# EAGLE design HBSTICK (EAGLE 9.6.2)
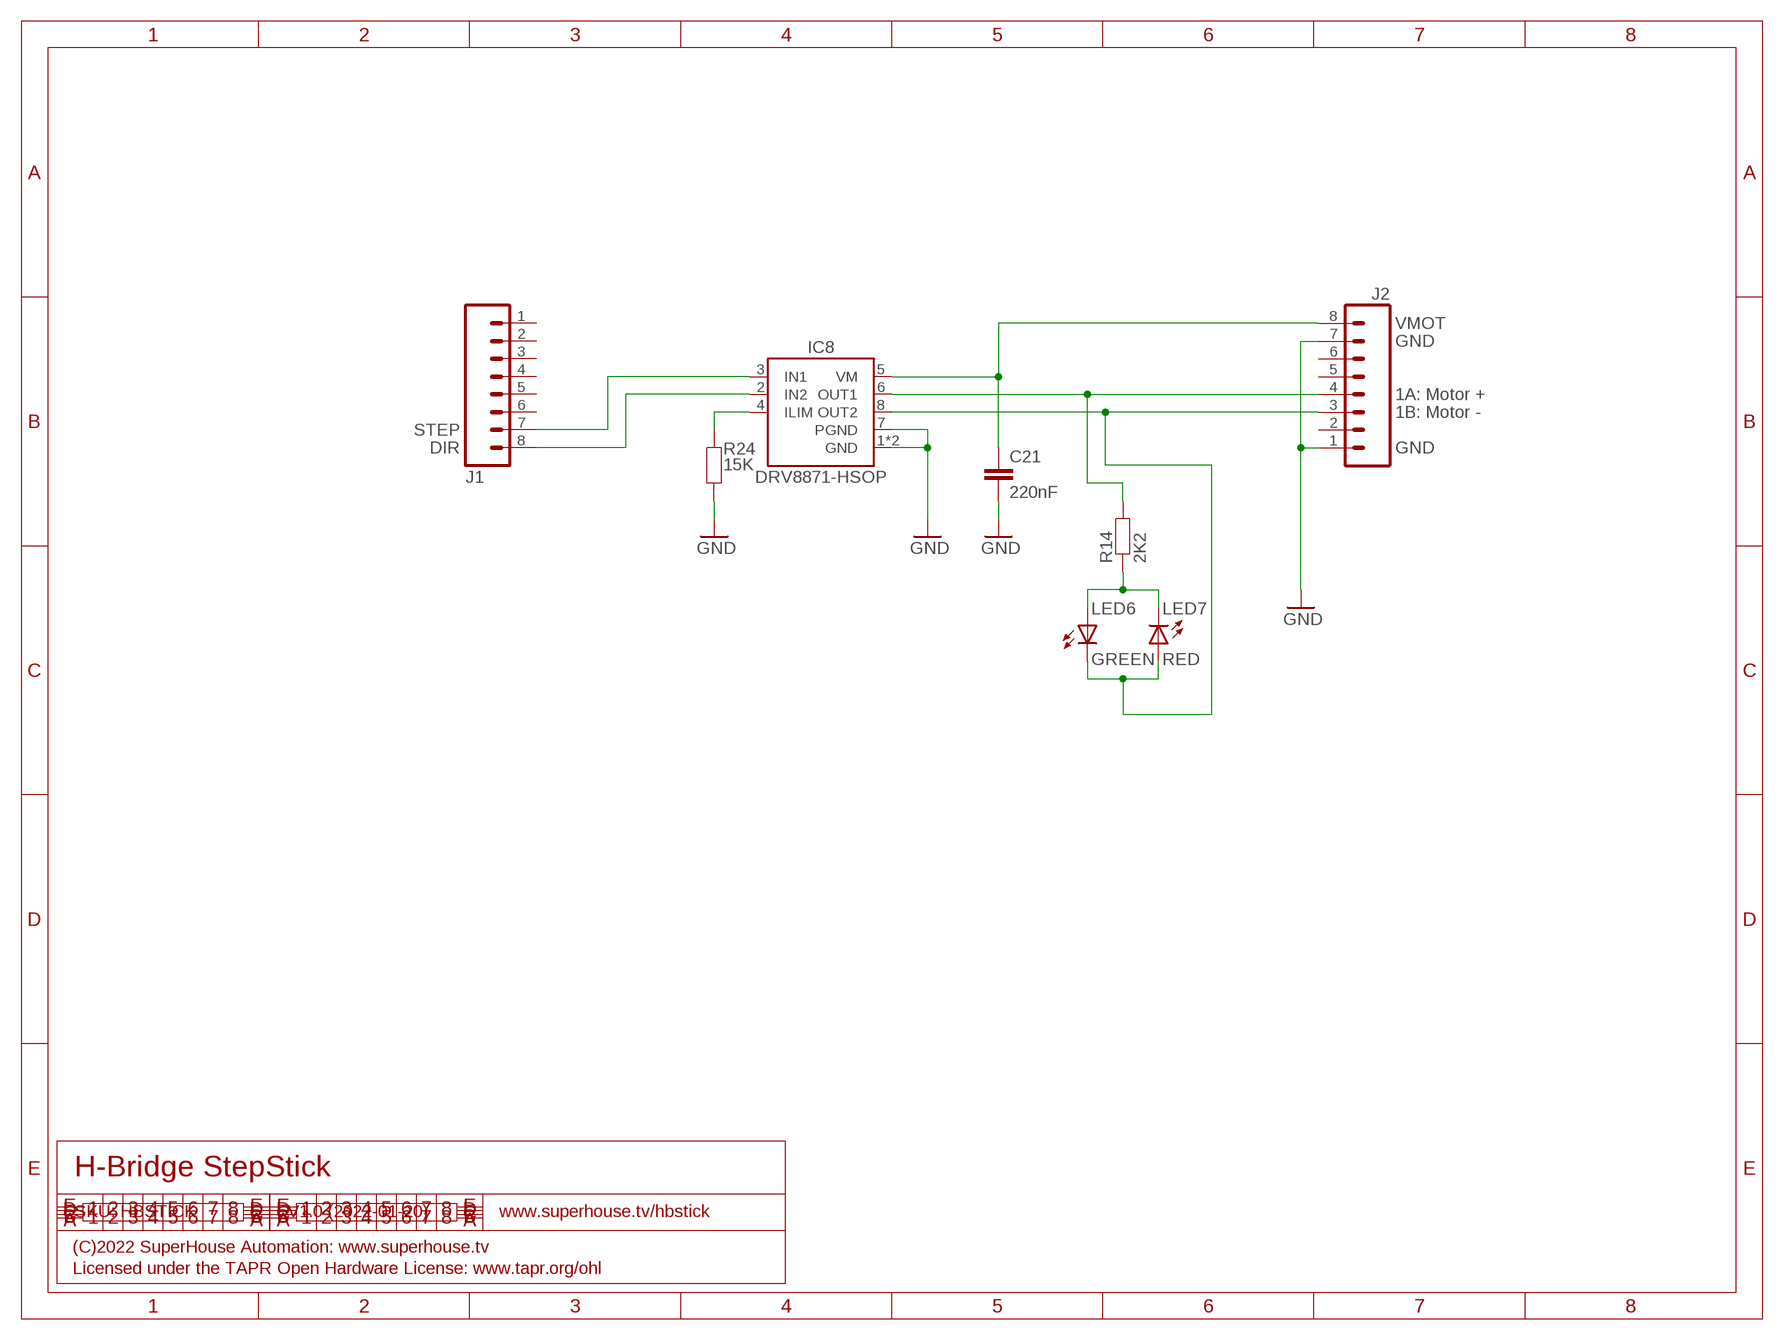
[diagram p0: schematic, sheet 1]

## Parts
C21  220nF  CAP0603  [C0603]
IC8  DRV8871-HSOP  [SOIC8T]
J1  M08-PIN-BELOW  [1X08-P-BELOW]
J2  M08-PIN-BELOW  [1X08-P-BELOW]
LED6  GREEN  LED0603  [LED-0603]
LED7  RED  LED0603  [LED-0603]
R14  2K2  RESISTOR0603  [R0603]
R24  15K  RESISTOR0603  [R0603]

## Nets
GND: C21.2 IC8.1(GND) IC8.7(PGND) IC8.TGND(GND) J2.1 J2.7 R24.1
MOTOR+: IC8.6(OUT1) J2.4 R14.2
MOTOR-: IC8.8(OUT2) J2.3 LED6.C LED7.A
N$1: IC8.2(IN2) J1.8
N$2: IC8.3(IN1) J1.7
N$8: LED6.A LED7.C R14.1
N$12: IC8.4(ILIM) R24.2
VIN+: C21.1 IC8.5(VM) J2.8
Unconnected: J1.1 J1.2 J1.3 J1.4 J1.5 J1.6 J2.2 J2.5 J2.6

## Notes on the sheet
- VMOT
- GND
- 1A: Motor +
- 1B: Motor -
- STEP
- DIR | GND
- H-Bridge StepStick
- SKU: HBSTICK | V1.0 (2022-01-20) | www.superhouse.tv/hbstick
- (C)2022 SuperHouse Automation: www.superhouse.tv
- Licensed under the TAPR Open Hardware License: www.tapr.org/ohl

## Library data of the parts
C21 = SuperHouse-Capacitors:CAP: Capacitor Standard ceramic capacitor
IC8 = SuperHouse-ICs:DRV8871: TI DRV8871 3.6A brushed DC motor driver
J1 J2 = SuperHouse-Connectors:M08: 8-way header Standard 1x8 header, and screw terminal variations
LED6 LED7 = SuperHouse-LEDs:LED: LEDs in various sizes including 5mm and 3mm PTH, and 0402, 0603, 0805, etc SMT
R14 R24 = SuperHouse-DiscreteSemi:RESISTOR: Resistor Standard resistors.

## Board
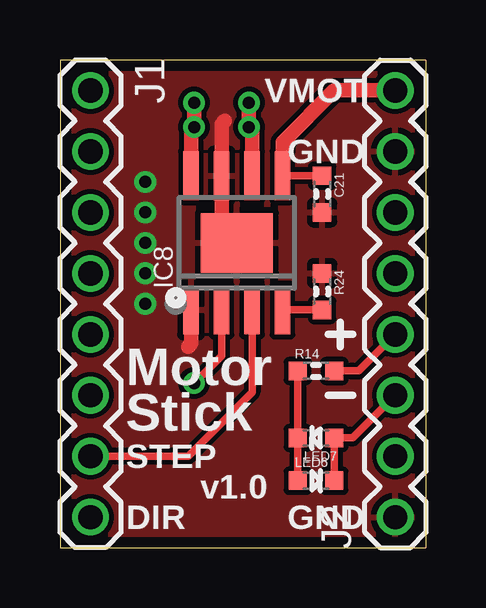
[diagram p1: board, top side]
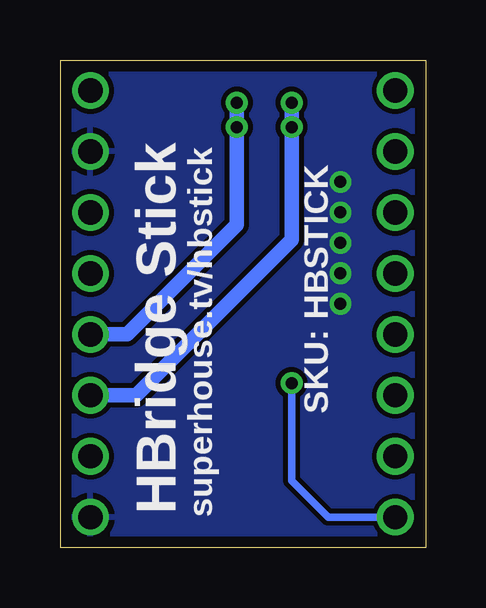
[diagram p2: board, bottom side, seen from below]

Size 15.24 x 20.32 mm. Coordinates in mm from the lower left corner, seen from the top.
Outline: 15.24,20.32 0,20.32 0,0 15.24,0 15.24,20.32
Copper layers (1*16): Top 0.035mm / dielectric 1.5mm / Bottom 0.035mm
Design rules "SuperHouse-Design-Rules *": minimum track width 10mil, minimum drill 24mil, track to track 8mil, track to pad 8mil, pad to pad 8mil, via to via 8mil, smd to smd 6mil, copper to edge 18mil, drill to drill 8mil, minimum pad ring 7mil, minimum via ring 8mil, stop-mask expansion 4mil, vias tented up to drill 0.5mm, thermal gap 10mil

### Footprints (pad centres in the part's own frame; a part is rotated, then mirrored left to right if it is on the bottom)
C0603 = smd 0.762 x 0.762: 1 -0.762,0; 2 0.762,0
SOIC8T = smd 2.032 x 0.66: 1 -2.794,1.905; 2 -2.794,0.635; 3 -2.794,-0.635; 4 -2.794,-1.905; 5 2.794,-1.905; 6 2.794,-0.635; 7 2.794,0.635; 8 2.794,1.905 | smd 2.489 x 2.997: TGND 0,0
1X08-P-BELOW = drill 1.016: 1 -8.89,0; 2 -6.35,0; 3 -3.81,0; 4 -1.27,0; 5 1.27,0; 6 3.81,0; 7 6.35,0; 8 8.89,0
LED-0603 = smd 0.762 x 0.762: A -0.762,0; C 0.762,0
R0603 = smd 0.762 x 0.762: 1 -0.762,0; 2 0.762,0

### Placement (x,y rotation side)
C21  10.92,14.73 270 top
IC8  7.37,12.7 90 top
J1  1.27,10.16 270 top
J2  13.97,10.16 90 top
LED6  10.67,2.79 0 top
LED7  10.67,4.57 180 top
R14  10.67,7.37 0 top
R24  10.92,10.67 270 top

### Tracks (layer width: path | path; a pad name or v marks a point on that pad's centre or on a via)
GND  (via drill 0.5)
  Top 0.61: IC8.TGND 6.73,13.34 IC8.7 6.73,17.65 6.86,17.78 | IC8.1 5.46,8.51 5.33,8.38
  other vias: 3.56,12.7 3.56,13.97 3.56,11.43 3.56,15.24 3.56,10.16
  pour Bottom: 15.24,20.32 15.24,0 0,0 0,20.32
  pour Top: 15.24,0 0,0 0,20.32 15.24,20.32
MOTOR+  (via drill 0.5)
  Top 0.305: R14.2 12.45,7.37 J2.4
  Top 0.61: v7.87,18.54 v7.87,17.53 8,17.4 IC8.6
  Bottom 0.61: J2.4 12.45,8.89 7.87,13.46 v7.87,17.53 v7.87,18.54
MOTOR-  (via drill 0.5)
  Top 0.305: LED6.C LED7.A 12.19,4.57 J2.3
  Top 0.61: v5.59,18.54 v5.59,17.53 5.46,17.4 IC8.8
  Bottom 0.61: v5.59,18.54 v5.59,17.53 5.59,12.82 12.06,6.35 J2.3
N$1  (via drill 0.5)
  Top 0.305: v5.59,6.86 6.73,8 IC8.2
  Bottom 0.305: J1.8 4.06,1.27 5.59,2.79 v5.59,6.86
N$2
  Top 0.305: IC8.3 8,6.48 5.33,3.81 J1.7
N$8
  Top 0.305: R14.1 LED7.C LED6.A
N$12
  Top 0.305: R24.2 IC8.4
VIN+
  Top 0.305: C21.1 IC8.5
  Top 0.61: IC8.5 9.27,16.89 11.43,19.05 J2.8

### Text on the board
tPlace: VMOT | GND | Motor / Stick | STEP | v1.0 | DIR | GND
bPlace: SKU: HBSTICK | superhouse.tv/hbstick | HBridge Stick